# Altium project TC_TP1.PrjPcb
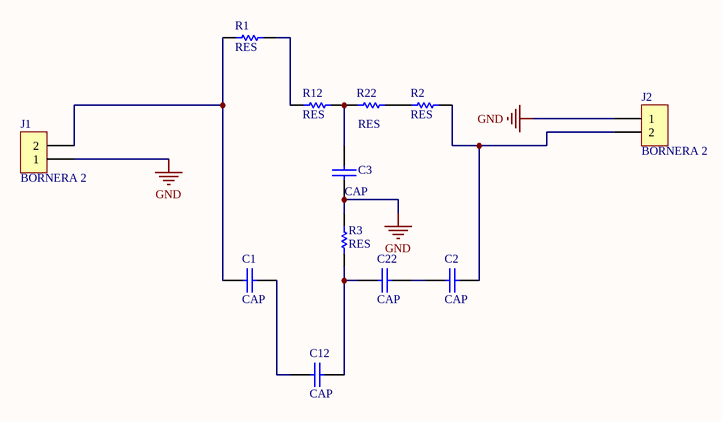
[diagram p0: Punto1.SchDoc]
1 sheet, 12 parts. Net scope: global (net labels, ports and power ports of the same name join across sheets).
Board file: PCB2.PcbDoc

## Sheet Punto1.SchDoc
size A

### Parts
C1  CAP  [CAP100]
C2  CAP  [CAP100]
C3  CAP  [CAP100]
C12  CAP  [CAP100]
C22  CAP  [CAP100]
J1  BORNERA 2  [BORNERA2]
J2  BORNERA 2  [BORNERA2]
R1  RES  [RES400]
R2  RES  [RES400]
R3  RES  [RES400]
R12  RES  [RES400]
R22  RES  [RES400]

### Nets
GND: C3.1 J1.1 J2.1 R3.2
NetC1_1: C1.1 J1.2 R1.1
NetC1_2: C1.2 C12.1
NetC2_1: C2.1 C22.2
NetC2_2: C2.2 J2.2 R2.2
NetC3_2: C3.2 R12.2 R22.1
NetC12_2: C12.2 C22.1 R3.1
NetR1_2: R1.2 R12.1
NetR2_1: R2.1 R22.2